# EAGLE schematic electrical diagram (EAGLE 6.0)
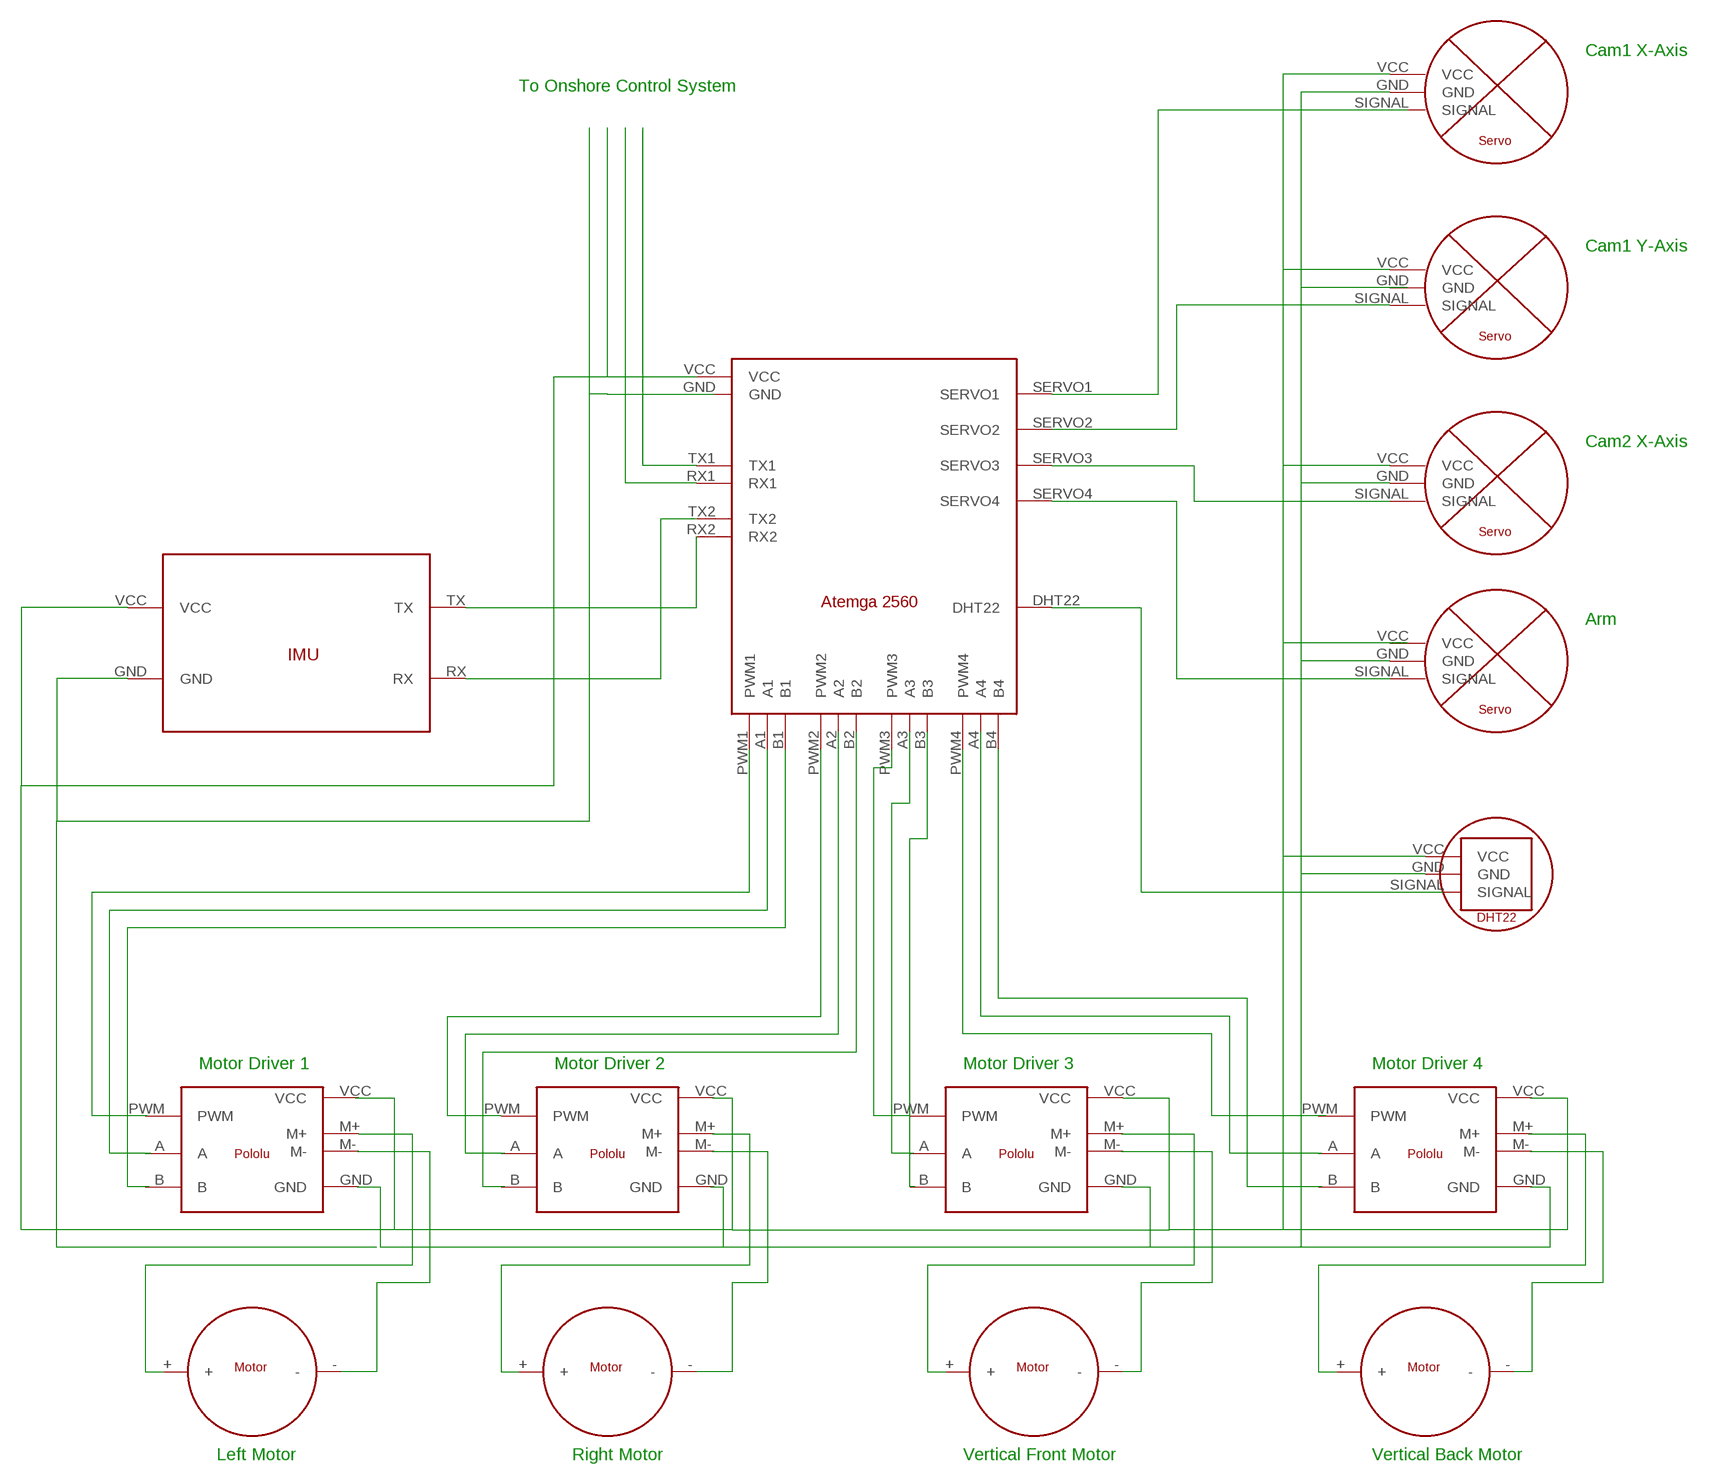
[diagram p0: schematic, sheet 1]

## Parts
U$2  POLOLU_MOTOR  [POLOLU_MOTOR]
U$3  POLOLU_MOTOR  [POLOLU_MOTOR]
U$4  POLOLU_MOTOR  [POLOLU_MOTOR]
U$5  POLOLU_MOTOR  [POLOLU_MOTOR]
U$6  MOTOR  [MOTOR]
U$7  MOTOR  [MOTOR]
U$8  MOTOR  [MOTOR]
U$9  MOTOR  [MOTOR]
U$10  SERVO  [SERVO]
U$11  SERVO  [SERVO]
U$12  SERVO  [SERVO]
U$13  SERVO  [SERVO]
U$14  ROV_MCU  [ROV_MCU]
U$15  IMU  [IMU]
U$16  DHT22  [DHT22]

## Nets
N$2: U$4.VCC U$10.VCC U$11.VCC U$12.VCC U$14.VCC U$15.VCC U$16.VCC
N$3: U$2.M+
N$5: U$10.GND U$12.GND U$13.GND U$16.GND
N$12: U$14.SERVO1
N$13: U$11.SIGNAL U$14.SERVO2
N$14: U$12.SIGNAL U$14.SERVO3
N$15: U$13.SIGNAL U$14.SERVO4
N$16: U$15.GND
N$17: U$14.RX2 U$15.TX
N$18: U$14.B1
N$19: U$14.A1
N$20: U$14.PWM1
N$23: U$3.PWM U$14.PWM2
N$24: U$4.PWM U$14.PWM3
N$27: U$14.PWM4
N$29: U$14.B4
N$30: U$14.TX2 U$15.RX
N$31: U$14.DHT22
N$32: U$14.TX1
N$33: U$14.RX1
Unconnected: U$2.A U$2.B U$2.GND U$2.M- U$2.PWM U$2.VCC U$3.A U$3.B U$3.GND U$3.M+ U$3.M- U$3.VCC U$4.A U$4.B U$4.GND U$4.M+ U$4.M- U$5.A U$5.B U$5.GND U$5.M+ U$5.M- U$5.PWM U$5.VCC U$6.+ U$6.- U$7.+ U$7.- U$8.+ U$8.- U$9.+ U$9.- U$10.SIGNAL U$11.GND U$13.VCC U$14.A2 U$14.A3 U$14.A4 U$14.B2 U$14.B3 U$14.GND U$16.SIGNAL

## Notes on the sheet
- Cam1 X-Axis
- To Onshore Control System
- Cam1 Y-Axis
- Cam2 X-Axis
- Arm
- Motor Driver 1 | Motor Driver 2 | Motor Driver 3 | Motor Driver 4
- Left Motor | Right Motor | Vertical Front Motor | Vertical Back Motor

## Library data of the parts
U$2-U$5 = rov:POLOLU_MOTOR
U$6-U$9 = rov:MOTOR
U$10-U$13 = rov:SERVO
U$14 = rov:ROV_MCU
U$15 = rov:IMU
U$16 = rov:DHT22